# EAGLE design Focuser (EAGLE 9.1.3)
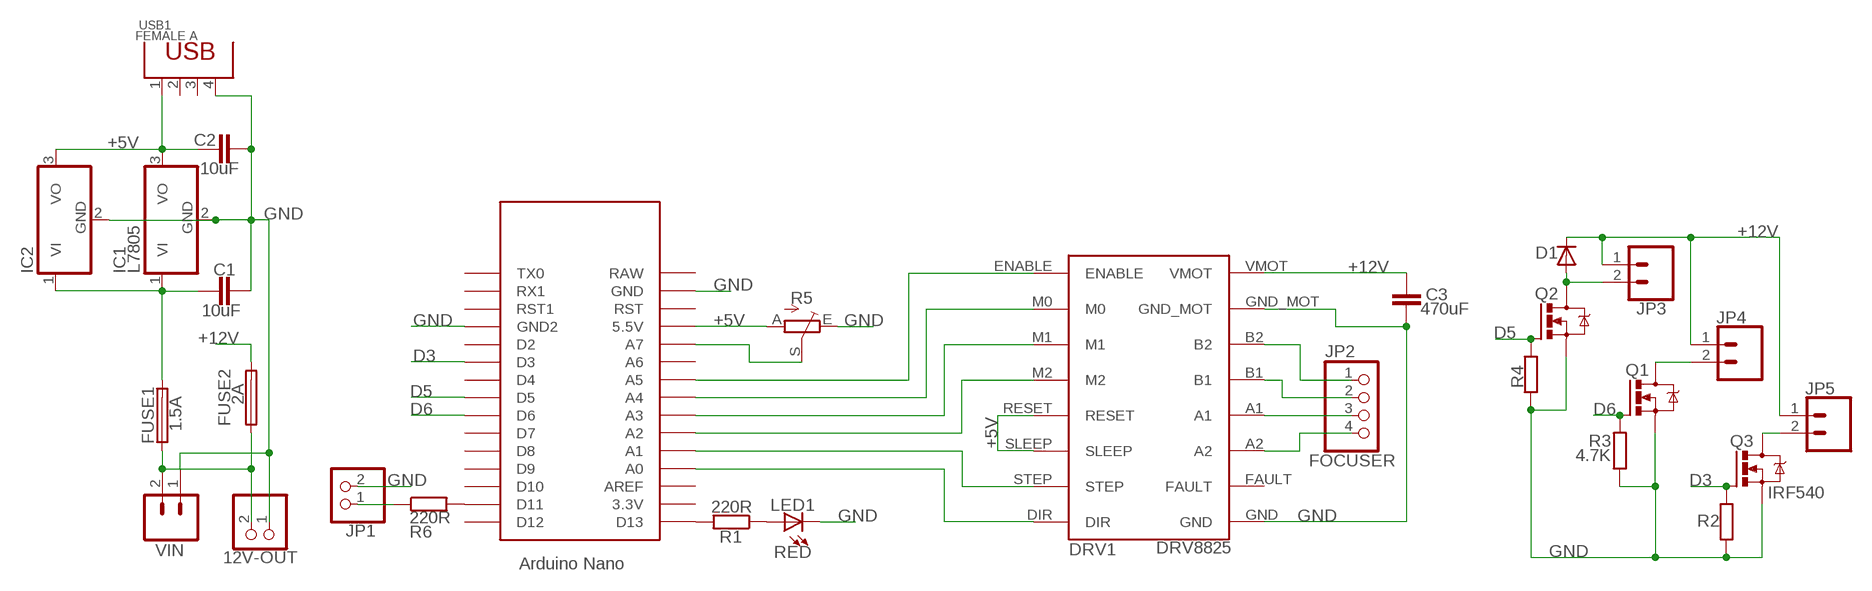
[diagram p0: schematic, sheet 1]

## Parts
12V-OUT  PINHD-1X2  [1X02]
C1  10uF  C-EU025-024X044  [C025-024X044]
C2  10uF  C-EU025-024X044  [C025-024X044]
C3  470uF  C5/2.5  [C5B2.5]
D1  DIODE-D-2.5  [D-2.5]
DRV1  DRV8825  [DRV8825]
FUSE1  1.5A  FUSEBLANK_5X20MM  [FUSE_HOLDER_5X20MM]
FUSE2  2A  FUSEBLANK_5X20MM  [FUSE_HOLDER_5X20MM]
IC1  L7805  786TV  [TO220V]
IC2  L7805  786TV  [TO220V]
JP1  PINHD-1X2  [1X02]
JP2  FOCUSER  PINHD-1X4  [1X04]
JP3  CONN_025MM  [SCREWTERMINAL-5MM-2]
JP4  CONN_025MM  [SCREWTERMINAL-5MM-2]
JP5  CONN_025MM  [SCREWTERMINAL-5MM-2]
LED1  RED  LED3MM  [LED3MM]
Q1  IRF540  [TO220BV]
Q2  IRF540  [TO220BV]
Q3  IRF540  [TO220BV]
R1  220R  R-EU_0204/5  [0204/5]
R2  4.7K  R-EU_0204/5  [0204/5]
R3  4.7K  R-EU_0204/5  [0204/5]
R4  4.7K  R-EU_0204/5  [0204/5]
R5  TRIM_EU-B64Y  [B64Y]
R6  220R  R-EU_0204/5  [0204/5]
U$1  NANO  [NANO]
USB1  FEMALE A  DIP-USB-A-TYPE-FMAL(4+2P-2.0-90D)  [USB4+2P-2.0-90D]
VIN  CONN_025MM  [SCREWTERMINAL-5MM-2]

## Nets
+5V: C2.1 DRV1.RESET DRV1.SLEEP IC1.3(VO) IC2.3(VO) R5.A U$1.5V(5.5V) USB1.1
+12V: C3.2 D1.C DRV1.VMOT FUSE2.2 JP3.1 JP4.1 JP5.1
D3: Q3.G R2.2 U$1.D3
D5: Q2.G R4.2 U$1.D5
D6: Q1.G R3.2 U$1.D6
D13: R1.2 U$1.D13
GND: 12V-OUT.1 C1.2 C2.2 C3.1 DRV1.GND DRV1.GND_MOT IC1.2(GND) IC2.2(GND) JP1.2 LED1.K(C) Q1.S Q2.S Q3.S R2.1 R3.1 R4.1 R5.E U$1.GND U$1.GND1(GND2) USB1.4 VIN.1
N$1: LED1.A R1.1
N$2: R5.S U$1.A7
N$3: R6.2 U$1.D11
N$4: C1.1 FUSE1.2 IC1.1(VI) IC2.1(VI)
N$5: DRV1.DIR U$1.A0
N$6: DRV1.ENABLE U$1.A5
N$8: 12V-OUT.2 FUSE1.1 FUSE2.1 VIN.2
N$9: D1.A JP3.2 Q2.D
N$10: JP4.2 Q1.D
N$11: JP5.2 Q3.D
N$12: DRV1.STEP U$1.A1
N$13: DRV1.B2 JP2.1
N$14: DRV1.B1 JP2.2
N$15: DRV1.A1 JP2.3
N$16: DRV1.A2 JP2.4
N$17: DRV1.M2 U$1.A2
N$18: DRV1.M1 U$1.A3
N$19: JP1.1 R6.1
N$20: DRV1.M0 U$1.A4
Unconnected: DRV1.FAULT U$1.3.3V U$1.A6 U$1.AREF U$1.D2 U$1.D4 U$1.D7 U$1.D8 U$1.D9 U$1.D10 U$1.D12 U$1.ICSP1 U$1.ICSP2 U$1.ICSP3 U$1.ICSP4 U$1.ICSP5 U$1.ICSP6 U$1.RAW U$1.RST U$1.RST1 U$1.RX1 U$1.TX0 USB1.2 USB1.3 USB1.SG1(GND) USB1.SG2(GND)

## Library data of the parts
12V-OUT = pinhead:PINHD-1X2: PIN HEADER
C1 C2 = rcl:C-EU: CAPACITOR, European symbol; SPICEPREFIX: C
C3 = capacitor-wima:C: CAPACITOR naming: grid - package width; SPICEPREFIX: C
D1 = diode:DIODE-: DIODE
DRV1 = 1:DRV8825: DRV8825 Stepper motor driver; SPICEPREFIX: X
FUSE1 FUSE2 = fuse:FUSE: Fuse; OC_FARNELL: unknown; OC_NEWARK: unknown
IC1 IC2 = linear:78*: Positive VOLTAGE REGULATOR Source: http://cache.national.com/ds/LM/LM78L05.pdf http://www.fairchildsemi.com/ds/LM/LM7805.pdf
JP1 = pinhead:PINHD-1X2: PIN HEADER; SPICEPREFIX: B
JP2 = pinhead:PINHD-1X4: PIN HEADER; SPICEPREFIX: E
JP3 JP4 VIN = SparkFun-Connectors:CONN_02: Multi connection point. Often used as Generic Header-pin footprint for 0.1 inch spaced/style header connections On any of the 0.1 inch spaced packages, you can populate with these: Break Away Headers - Straight <https://www.sparkfun.com/products/116> (PRT-00116) Break Away Male Headers - Right Angle <https://www.sparkfun.com/products/553> (PRT-00553) Female Headers <https://www.sparkfun.com/products/115> (PRT-00115) Break Away Headers - Machine Pin <https://www.sparkfun.com/products/117> (PRT-00117) Break Away Female Headers - Swiss Machine Pin <https://www.sparkfun.com/products/743> (PRT-00743) For SCREWTERMINALS and SPRING TERMINALS visit here: Screw Terimnals on SparkFun.com <https://www.sparkfun.com/search/results?term=Screw+Terminals> (5mm/3.5mm/2.54mm spacing) This device is also useful as a general connection point to wire up your design to another part of your project. Our various solder wires solder well into these plated through hole pads. Hook-Up Wire - Assortment (Stranded, 22 AWG) <https://www.sparkfun.com/products/11375> (PRT-11375) Hook-Up Wire - Assortment (Solid Core, 22 AWG) <https://www.sparkfun.com/products/11367> (PRT-11367) View the entire wire category on our website here <https://www.sparkfun.com/categories/141> Special notes: Molex polarized connector foot print use with: PRT-08233 with associated crimp pins and housings. 2.54_SCREWTERM for use with PRT-10571. 3.5mm Screw Terminal footprints for PRT-08084 5mm Screw Terminal footprints for use with PRT-08432; SF_SKU: PRT-08432
JP5 = SparkFun-Connectors:CONN_02: Multi connection point. Often used as Generic Header-pin footprint for 0.1 inch spaced/style header connections On any of the 0.1 inch spaced packages, you can populate with these: Break Away Headers - Straight <https://www.sparkfun.com/products/116> (PRT-00116) Break Away Male Headers - Right Angle <https://www.sparkfun.com/products/553> (PRT-00553) Female Headers <https://www.sparkfun.com/products/115> (PRT-00115) Break Away Headers - Machine Pin <https://www.sparkfun.com/products/117> (PRT-00117) Break Away Female Headers - Swiss Machine Pin <https://www.sparkfun.com/products/743> (PRT-00743) For SCREWTERMINALS and SPRING TERMINALS visit here: Screw Terimnals on SparkFun.com <https://www.sparkfun.com/search/results?term=Screw+Terminals> (5mm/3.5mm/2.54mm spacing) This device is also useful as a general connection point to wire up your design to another part of your project. Our various solder wires solder well into these plated through hole pads. Hook-Up Wire - Assortment (Stranded, 22 AWG) <https://www.sparkfun.com/products/11375> (PRT-11375) Hook-Up Wire - Assortment (Solid Core, 22 AWG) <https://www.sparkfun.com/products/11367> (PRT-11367) View the entire wire category on our website here <https://www.sparkfun.com/categories/141> Special notes: Molex polarized connector foot print use with: PRT-08233 with associated crimp pins and housings. 2.54_SCREWTERM for use with PRT-10571. 3.5mm Screw Terminal footprints for PRT-08084 5mm Screw Terminal footprints for use with PRT-08432; SF_SKU: PRT-08432; SPICEPREFIX: H
LED1 = adafruit:LED: LED OSRAM: - CHIPLED LG R971, LG N971, LY N971, LG Q971, LY Q971, LO R971, LY R971 LH N974, LH R974 LS Q976, LO Q976, LY Q976 LO Q996 - Hyper CHIPLED LW Q18S LB Q993, LB Q99A, LB R99A - SideLED LS A670, LO A670, LY A670, LG A670, LP A670 LB A673, LV A673, LT A673, LW A673 LH A674 LY A675 LS A676, LA A676, LO A676, LY A676, LW A676 LS A679, LY A679, LG A679 - Hyper Micro SIDELED® LS Y876, LA Y876, LO Y876, LY Y876 LT Y87S - SmartLED LW L88C, LW L88S LB L89C, LB L89S, LG L890 LS L89K, LO L89K, LY L89K LS L896, LA L896, LO L896, LY L896 - TOPLED LS T670, LO T670, LY T670, LG T670, LP T670 LSG T670, LSP T670, LSY T670, LOP T670, LYG T670 LG T671, LOG T671, LSG T671 LB T673, LV T673, LT T673, LW T673 LH T674 LS T676, LA T676, LO T676, LY T676, LB T676, LH T676, LSB T676, LW T676 LB T67C, LV T67C, LT T67C, LS T67K, LO T67K, LY T67K, LW E67C LS E67B, LA E67B, LO E67B, LY E67B, LB E67C, LV E67C, LT E67C LW T67C LS T679, LY T679, LG T679 LS T770, LO T770, LY T770, LG T770, LP T770 LB T773, LV T773, LT T773, LW T773 LH T774 LS E675, LA E675, LY E675, LS T675 LS T776, LA T776, LO T776, LY T776, LB T776 LHGB T686 LT T68C, LB T68C - Hyper Mini TOPLED® LB M676 - Mini TOPLED Santana® LG M470 LS M47K, LO M47K, LY M47K Source: http://www.osram.convergy.de/; SPICEPREFIX: L
Q1-Q3 = transistor-power:IRF540: HEXFET Power MOSFET
R1 R6 = resistor:R-EU_: RESISTOR, European symbol; SPICEPREFIX: R
R2-R4 = rcl:R-EU_: RESISTOR, European symbol; SPICEPREFIX: R
R5 = pot:TRIM_EU-: POTENTIOMETER; SPICEPREFIX: J
U$1 = Arduino-clone:NANO: Arduino Nano
USB1 = Seeed-Connector:DIP-USB-A-TYPE-FMAL(4+2P-2.0-90D): 320010007; VALUE: USB4-2.0-90D

## Board
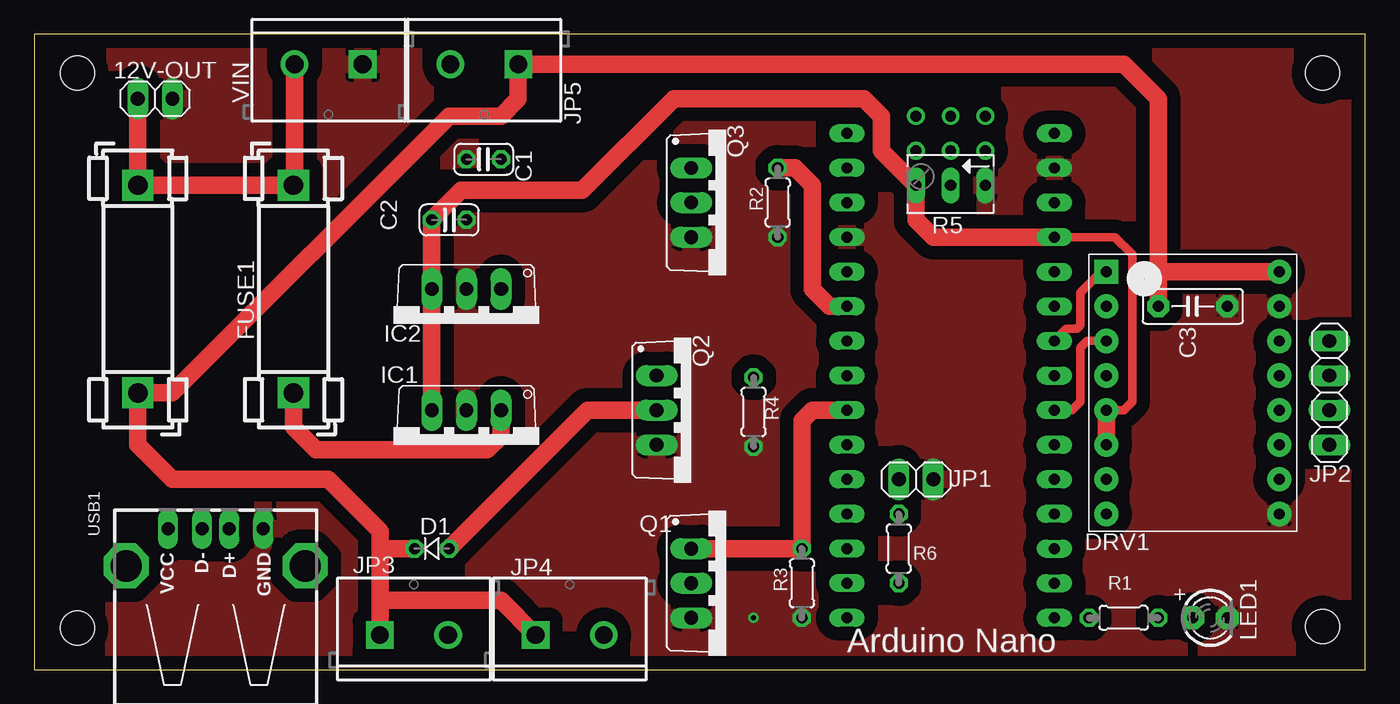
[diagram p1: board, top side]
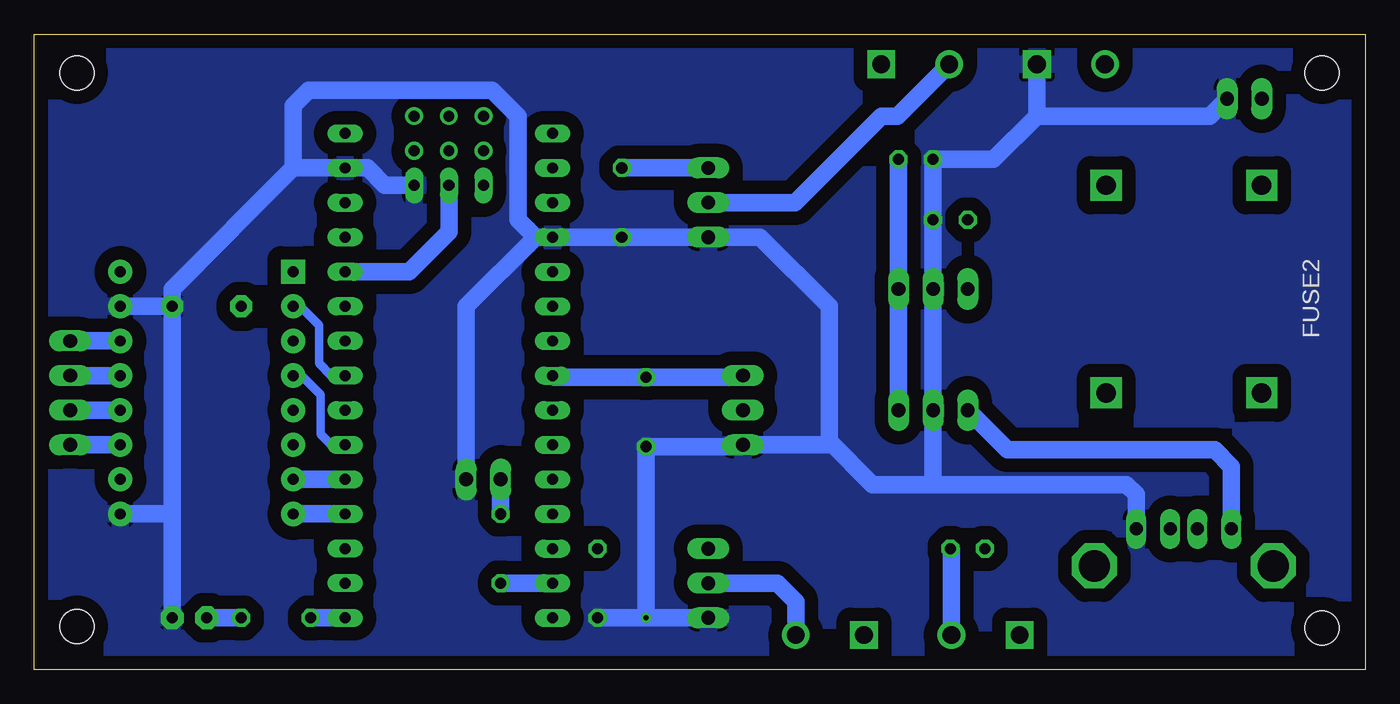
[diagram p2: board, bottom side, seen from below]

Size 97.77 x 46.66 mm. Coordinates in mm from the lower left corner, seen from the top.
Outline: 0,0 97.77,0 97.77,46.66 0,46.66 0,0
Copper layers (1*16): Top 0.035mm / dielectric 1.5mm / Bottom 0.035mm
Design rules "default": minimum track width 6mil, minimum drill 0.35mm, track to track 6mil, track to pad 6mil, pad to pad 6mil, via to via 6mil, smd to smd 6mil, copper to edge 40mil, drill to drill 6mil, minimum pad ring 10mil, minimum via ring 8mil, stop-mask expansion 4mil, vias tented up to drill 0mil, thermal gap 10mil
Holes 2.5 mm at 3.18,43.81 3.18,3.05 94.62,43.81 94.62,3.18

### Footprints (pad centres in the part's own frame; a part is rotated, then mirrored left to right if it is on the bottom)
1X02 = drill 1.016 long: 1 -1.27,0; 2 1.27,0
C025-024X044 = drill 0.813 octagon: 1 -1.27,0; 2 1.27,0
C5B2.5 = drill 0.813 pad 1.6 octagon: 1 -2.54,0; 2 2.54,0
D-2.5 = drill 0.813 octagon: A 1.27,0; C -1.27,0
DRV8825 = drill 0.8 pad 1.778: A1 13.97,-11.43; A2 13.97,-13.97; B1 13.97,-8.89; B2 13.97,-6.35; DIR 1.27,-19.05; FAULT 13.97,-16.51; GND 13.97,-19.05; GND_MOT 13.97,-3.81; M0 1.27,-3.81; M1 1.27,-6.35; M2 1.27,-8.89; RESET 1.27,-11.43; SLEEP 1.27,-13.97; STEP 1.27,-16.51; VMOT 13.97,-1.27 | drill 0.8 pad 1.778 square: ENABLE 1.27,-1.27
FUSE_HOLDER_5X20MM = drill 1.422 pad 2.286 square: 1 0,0; 2 15.24,0
TO220V = drill 1.016 long: 1 -2.54,-2.54; 2 0,-2.54; 3 2.54,-2.54
1X04 = drill 1.016 long: 1 -3.81,0; 2 -1.27,0; 3 1.27,0; 4 3.81,0
SCREWTERMINAL-5MM-2 = drill 1.3 pad 2.032 square: 1 0,0 | drill 1.3 pad 2.032: 2 5,0
LED3MM = drill 0.813 pad 1.676 octagon: A -1.27,0; K 1.27,0
TO220BV = drill 1.016 long: D 0,-2.54; G -2.54,-2.54; S 2.54,-2.54
0204/5 = drill 0.813 octagon: 1 -2.54,0; 2 2.54,0
B64Y = drill 0.813 long: A 2.54,0; E -2.54,0; S 0,0
NANO = drill 0.8 long: 3.3V -10.16,24.13; 5V -10.16,-1.27; A0 -10.16,19.05; A1 -10.16,16.51; A2 -10.16,13.97; A3 -10.16,11.43; A4 -10.16,8.89; A5 -10.16,6.35; A6 -10.16,3.81; A7 -10.16,1.27; AREF -10.16,21.59; D2 5.08,1.27; D3 5.08,3.81; D4 5.08,6.35; D5 5.08,8.89; D6 5.08,11.43; D7 5.08,13.97; D8 5.08,16.51; D9 5.08,19.05; D10 5.08,21.59; D11 5.08,24.13; D12 5.08,26.67; D13 -10.16,26.67; GND -10.16,-6.35; GND1 5.08,-1.27; RAW -10.16,-8.89; RST -10.16,-3.81; RST1 5.08,-3.81; RX1 5.08,-6.35; TX0 5.08,-8.89 | drill 0.8: ICSP1 -5.08,-10.16; ICSP2 -5.08,-7.62; ICSP3 -2.54,-10.16; ICSP4 -2.54,-7.62; ICSP5 0,-10.16; ICSP6 0,-7.62
USB4+2P-2.0-90D = drill 0.95 long: 1 -3.5,2.71; 2 -1,2.71; 3 1,2.71; 4 3.5,2.71 | drill 2.3 octagon: SG1 -6.57,0; SG2 6.57,0

### Placement (x,y rotation side)
12V-OUT  8.89,41.91 180 top
C1  33.02,37.47 180 top
C2  30.48,33.02 0 top
C3  85.09,26.67 180 top
D1  29.21,8.89 0 top
DRV1  77.47,30.48 0 top
FUSE1  19.05,35.56 270 top
FUSE2  7.62,35.56 270 top
IC1  31.75,16.51 180 top
IC2  31.75,25.4 180 top
JP1  64.77,13.97 0 top
JP2  95.12,20.32 270 top
JP3  25.4,2.54 0 top
JP4  36.83,2.54 0 top
JP5  35.56,44.45 180 top
LED1  86.36,3.81 0 top
Q1  50.8,6.35 270 top
Q2  48.26,19.05 270 top
Q3  50.8,34.29 270 top
R1  80.01,3.81 180 top
R2  54.61,34.29 90 top
R3  56.39,6.35 90 top
R4  52.83,18.92 90 top
R5  67.31,35.56 180 top
R6  63.5,8.89 270 top
U$1  64.77,30.48 180 top
USB1  13.34,7.62 0 top
VIN  24.13,44.45 180 top

### Tracks (layer width: path | path; a pad name or v marks a point on that pad's centre or on a via)
+5V
  Top 0.61: U$1.5V 79.38,31.75 80.64,30.48 80.64,19.69 80.01,19.05 DRV1.RESET
  Top 1.27: U$1.5V 66.04,31.75 64.77,33.02 R5.A 62.23,38.1 62.23,40.64 60.96,41.91 46.99,41.91 40.26,35.18 31.37,35.18 C2.1 IC2.3 IC1.3 | DRV1.RESET DRV1.SLEEP
  Bottom 1.27: USB1.1 9.84,14.92 11.05,16.13 26.29,16.13 IC1.3
+12V
  Top 1.27: DRV1.VMOT 82.55,29.21 82.55,29.08 | 25.4,8.89 25.4,10.16 21.59,13.97 10.16,13.97 7.62,16.51 FUSE2.2 10.16,20.32 30.48,40.64 34.29,40.64 35.56,41.91 JP5.1 80.01,44.45 82.55,41.91 82.55,29.08 | 25.4,8.89 25.4,5.08 | 25.4,5.08 JP3.1 | JP4.1 34.29,5.08 25.4,5.08 | D1.C 25.4,8.89 | C3.2 82.55,29.08
D3
  Top 1.27: R2.2 55.88,36.83 57.15,35.56 57.15,27.94 58.42,26.67 U$1.D3
  Bottom 1.27: Q3.G R2.2
D5
  Bottom 1.27: Q2.G 45.85,21.46 R4.2 59.56,21.46 U$1.D5
D6
  Top 1.27: Q1.G R3.2 56.39,18.29 57.15,19.05 U$1.D6
D13
  Bottom 1.27: R1.2 U$1.D13
GND  (via drill 0.35)
  Bottom 1.27: Q1.S v52.83,3.81 | C3.1 DRV1.GND_MOT | 87.63,11.56 87.76,11.43 DRV1.GND | 78.74,36.83 U$1.GND 73.28,36.83 72.01,35.56 R5.E | v52.83,3.81 R3.1 | 31.62,13.59 31.75,13.72 IC1.2 IC2.2 C2.2 C1.2 27.3,37.47 24.13,40.64 | 31.62,13.59 36.2,13.59 39.37,16.76 | 39.37,16.76 39.37,26.67 44.45,31.75 Q3.S R2.1 U$1.GND1 60.96,31.75 | 60.96,31.75 62.23,33.02 62.23,40.64 64.14,42.55 77.6,42.55 78.74,41.4 78.74,36.83 | JP1.2 66.04,26.67 60.96,31.75 | 39.37,16.76 39.37,16.51 Q2.S 45.85,16.38 R4.1 v52.83,3.81 | 87.63,11.56 C3.1 | LED1.K 87.63,11.56 | USB1.4 16.84,12.87 17.55,13.59 30.23,13.59 31.62,13.59 | 12V-OUT.1 11.43,40.64 24.13,40.64 | VIN.1 24.13,40.64 | 78.74,36.83 87.63,27.94 C3.1
  pour Bottom (isolate 1): 0,46.99 0,0 97.79,0 97.79,46.99
  pour Top (isolate 1): 0,46.99 0,0 97.79,0 97.79,46.99
N$1
  Bottom 1.27: R1.1 LED1.A
N$2
  Bottom 1.27: U$1.A7 70.23,29.21 67.31,32.13 R5.S
N$3
  Bottom 1.27: U$1.D11 R6.2
N$4
  Top 1.27: FUSE1.2 19.05,17.78 20.7,16.13 33.27,16.13 34.29,17.15 IC1.1
  Bottom 1.27: IC1.1 IC2.1 C1.1
N$5
  Bottom 1.27: U$1.A0 DRV1.DIR
N$6
  Top 0.61: DRV1.ENABLE 78.36,29.21 76.84,27.69 76.84,25.27 76.58,25.02 75.82,25.02 U$1.A5
N$8
  Top 1.27: 12V-OUT.2 FUSE2.1 FUSE1.1 19.13,35.64 VIN.2
N$9
  Top 1.27: D1.A 40.64,19.05 Q2.D
  Bottom 1.27: D1.A 30.4,8.81 JP3.2
N$10
  Bottom 1.27: Q1.D 43.18,6.35 41.83,5 JP4.2
N$11
  Bottom 1.27: Q3.D 41.91,34.29 35.56,40.64 34.37,40.64 JP5.2
N$12
  Bottom 1.27: DRV1.STEP U$1.A1
N$13
  Bottom 1.27: DRV1.B2 JP2.1
N$14
  Bottom 1.27: DRV1.B1 JP2.2
N$15
  Bottom 1.27: DRV1.A1 JP2.3
N$16
  Bottom 1.27: DRV1.A2 JP2.4
N$17
  Bottom 0.61: 78.23,21.59 DRV1.M2 78.11,21.59 76.71,20.19 76.71,17.27 75.95,16.51 U$1.A2
N$18
  Top 0.61: DRV1.M1 77.34,24.13 76.84,23.62 76.84,19.69 76.2,19.05 U$1.A3
  Bottom 0.61: 78.23,24.13 DRV1.M1
N$19
  Bottom 1.27: JP1.1 R6.1
N$20
  Bottom 0.61: U$1.A4 75.95,21.59 76.84,22.48 76.84,25.27 78.23,26.67 DRV1.M0

### Text on the board
tNames: Arduino Nano